# Altium schematic sheet SRAM25616.SchDoc
size A4
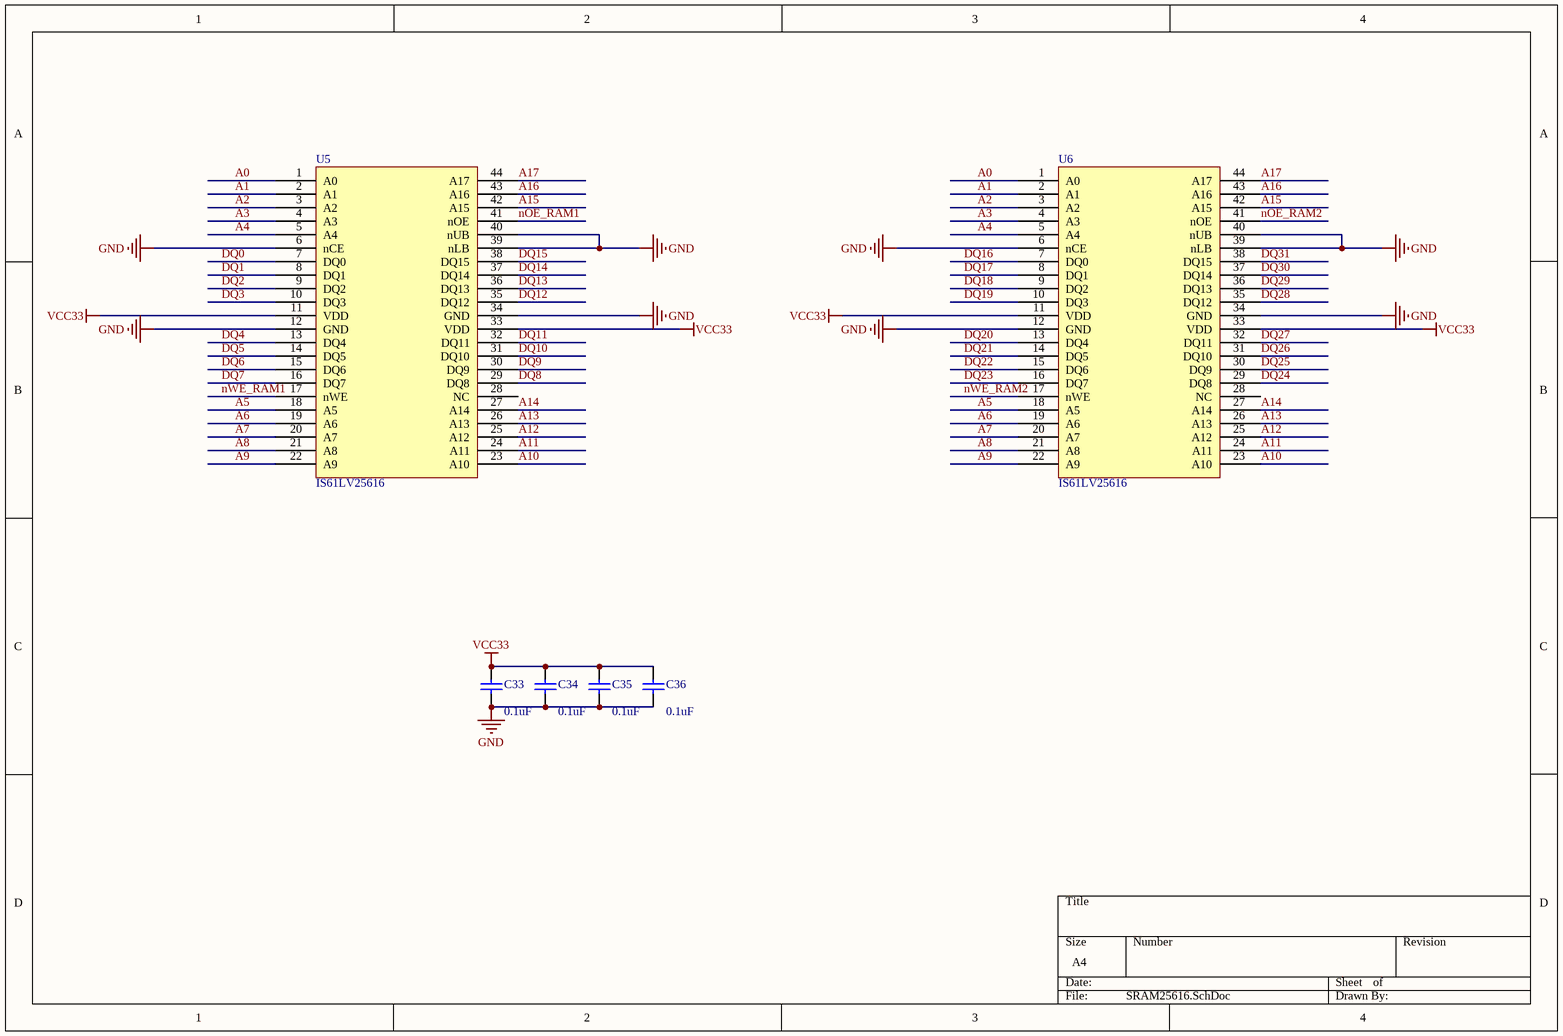
[diagram p0: SRAM25616.SchDoc]

## Parts
C33  value 0.1uF  [cc0603]
C34  value 0.1uF  [cc0603]
C35  value 0.1uF  [cc0603]
C36  value 0.1uF  [cc0603]
U5  IS61LV25616  [IS61LV25616]
U6  IS61LV25616  [IS61LV25616]

## Nets
GND: C33.1 C34.1 C35.1 C36.1 U5.6(nCE) U5.12(GND) U5.34(GND) U5.39(nLB) U5.40(nUB) U6.6(nCE) U6.12(GND) U6.34(GND) U6.39(nLB) U6.40(nUB)
VCC33: C33.2 C34.2 C35.2 C36.2 U5.11(VDD) U5.33(VDD) U6.11(VDD) U6.33(VDD)
A0: U5.1(A0) U6.1(A0)
A1: U5.2(A1) U6.2(A1)
A2: U5.3(A2) U6.3(A2)
A3: U5.4(A3) U6.4(A3)
A4: U5.5(A4) U6.5(A4)
A5: U5.18(A5) U6.18(A5)
A6: U5.19(A6) U6.19(A6)
A7: U5.20(A7) U6.20(A7)
A8: U5.21(A8) U6.21(A8)
A9: U5.22(A9) U6.22(A9)
A10: U5.23(A10) U6.23(A10)
A11: U5.24(A11) U6.24(A11)
A12: U5.25(A12) U6.25(A12)
A13: U5.26(A13) U6.26(A13)
A14: U5.27(A14) U6.27(A14)
A15: U5.42(A15) U6.42(A15)
A16: U5.43(A16) U6.43(A16)
A17: U5.44(A17) U6.44(A17)
DQ0: U5.7(DQ0)
DQ1: U5.8(DQ1)
DQ2: U5.9(DQ2)
DQ3: U5.10(DQ3)
DQ4: U5.13(DQ4)
DQ5: U5.14(DQ5)
DQ6: U5.15(DQ6)
DQ7: U5.16(DQ7)
DQ8: U5.29(DQ8)
DQ9: U5.30(DQ9)
DQ10: U5.31(DQ10)
DQ11: U5.32(DQ11)
DQ12: U5.35(DQ12)
DQ13: U5.36(DQ13)
DQ14: U5.37(DQ14)
DQ15: U5.38(DQ15)
DQ16: U6.7(DQ0)
DQ17: U6.8(DQ1)
DQ18: U6.9(DQ2)
DQ19: U6.10(DQ3)
DQ20: U6.13(DQ4)
DQ21: U6.14(DQ5)
DQ22: U6.15(DQ6)
DQ23: U6.16(DQ7)
DQ24: U6.29(DQ8)
DQ25: U6.30(DQ9)
DQ26: U6.31(DQ10)
DQ27: U6.32(DQ11)
DQ28: U6.35(DQ12)
DQ29: U6.36(DQ13)
DQ30: U6.37(DQ14)
DQ31: U6.38(DQ15)
nOE_RAM1: U5.41(nOE)
nOE_RAM2: U6.41(nOE)
nWE_RAM1: U5.17(nWE)
nWE_RAM2: U6.17(nWE)

Not connected (* = marked no-connect by the designer): U5 28(NC); U6 28(NC)

## Library data of the parts
C33-C36 = Cap: Capacitor; Published: 8-Jun-2000; LatestRevisionDate: 17-Jul-2002; LatestRevisionNote: Re-released for DXP Platform.; PackageReference: RAD-0.3; Publisher: Altium Limited